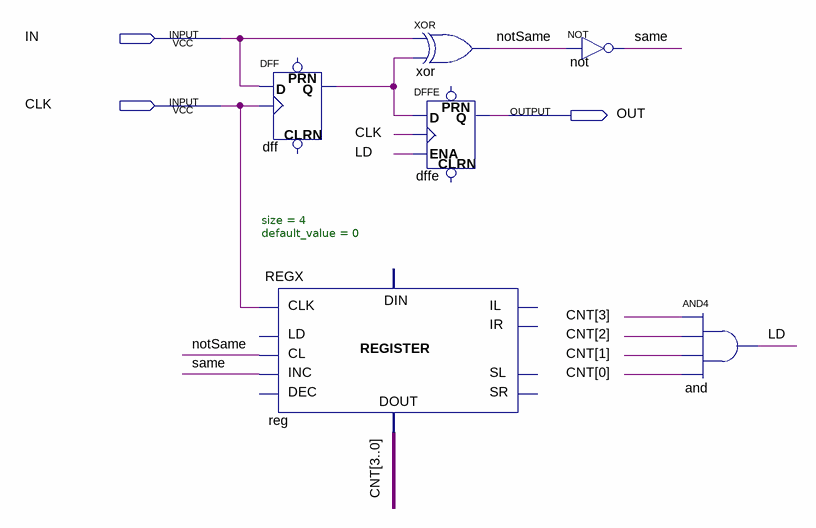
[diagram p0: schematic sheet]
// Quartus schematic Debouncer.bdf as structural Verilog: 6 symbols, 3 pins
module Debouncer (
  input  IN,
  input  CLK,
  output OUT
);

  wire dff_q, LD, notSame, same;
  wire [3:0] CNT;

  DFF dff (.CLK(CLK), .D(IN), .Q(dff_q));  // open: CLRN, PRN
  REGX #(.size(4), .default_value(0)) \reg  (
    .clk(CLK), .cl(notSame), .inc(same), .data_out(CNT));  // open: data_in, ld, dec, il, ir, sl, sr
  xor \xor  (notSame, IN, dff_q);
  DFFE dffe (.D(dff_q), .CLK(CLK), .ENA(LD), .Q(OUT));  // open: PRN, CLRN
  not \not  (same, notSame);
  and \and  (LD, CNT[3], CNT[2], CNT[1], CNT[0]);
endmodule
